# Altium project 23005.PrjPCB
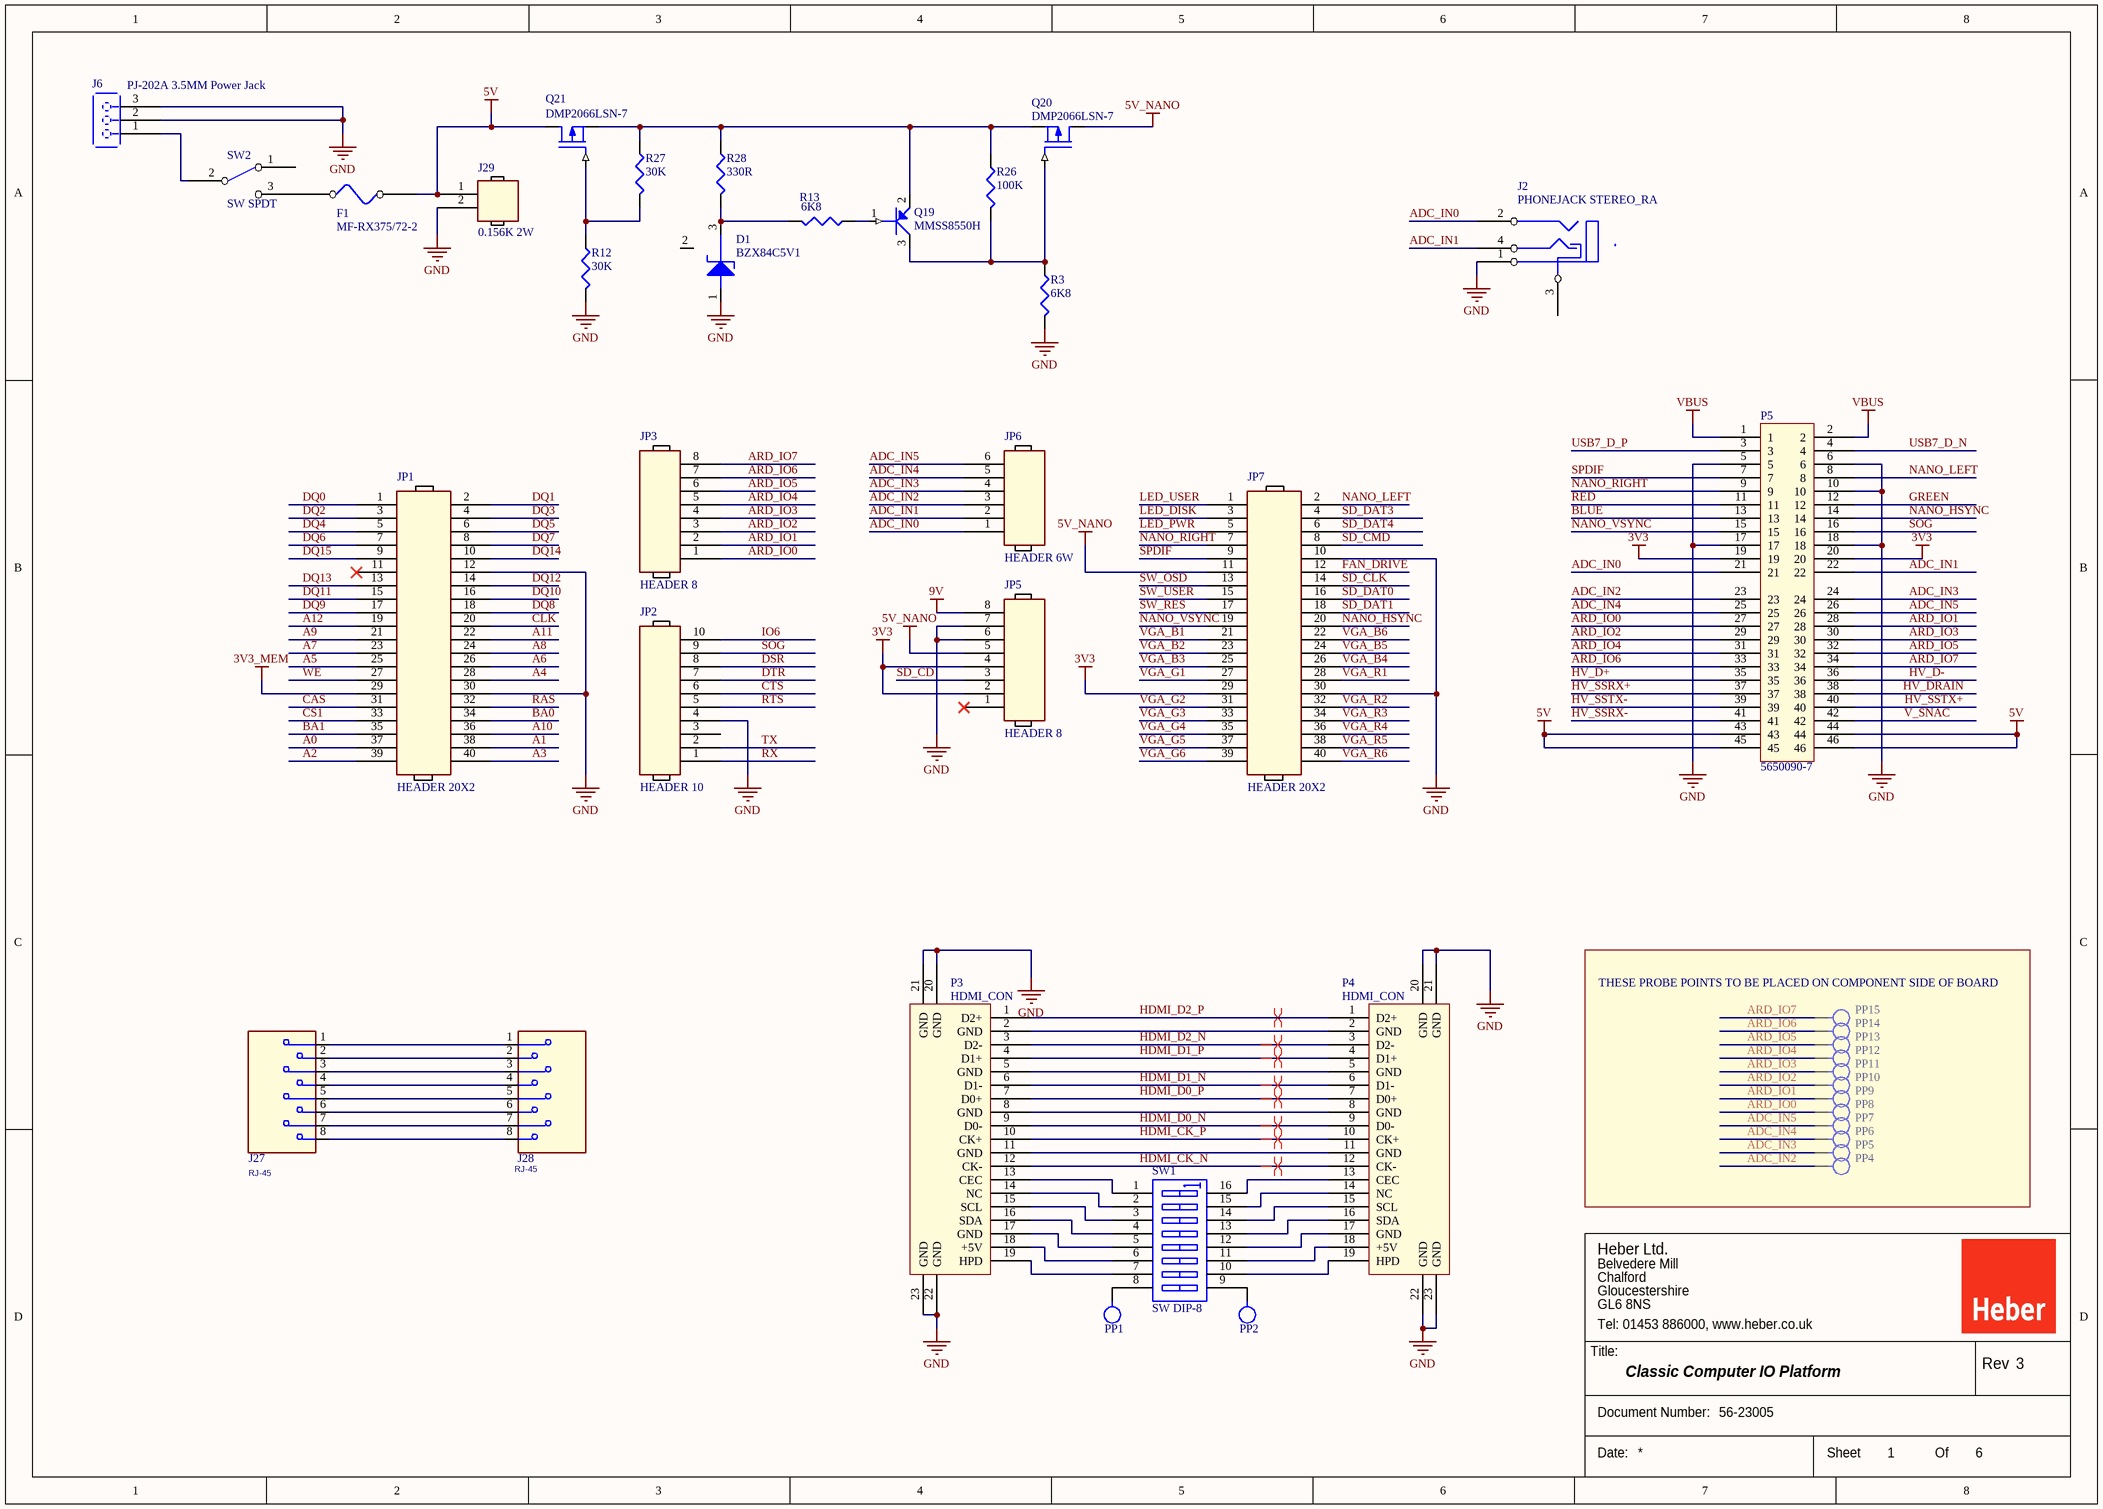
[diagram p0: 23005_1.SchDoc]
6 sheets, 179 parts. Net scope: global (net labels, ports and power ports of the same name join across sheets).
Board file: 23005.PcbDoc
Sheets:
  23005_1.SchDoc
  23005_2.SchDoc
  23005_3.SchDoc
  23005_4.SchDoc
  23005_5.SchDoc
  23005_6.SchDoc

## Sheet 23005_1.SchDoc: Classic Computer IO Platform
size A3; Date: 06/11/2018; CompanyName: Heber Ltd; Organization: Heber Limited; DocumentNumber: 56-23005; 1: 1; SheetNumber: 1; SheetTotal: 6; Revision: 2

### Parts
D1  BZX84C5V1  [SOT23]
F1  MF-RX375/72-2  [FUSE-MF-RX375/72-2]
J2  PHONEJACK STEREO_RA  [JACKSOCKET-STEREO]
J6  PJ-202A 3.5MM Power Jack  [CUI_PJ-202A]
J27  RJ-45  [P-RJHSE-XE80]
J28  RJ-45  [P-RJHSE-XE80]
J29  0.156K 2W  [2W156KK]
JP1  HEADER 20X2  [40WHDR_20X2 - DE10-NANO]
JP2  HEADER 10  [10WSIL]
JP3  HEADER 8  [8WSIL]
JP5  HEADER 8  [8WSIL]
JP6  HEADER 6W  [6WSIL]
JP7  HEADER 20X2  [40WHDR_20X2 - DE10-NANO]
P3  HDMI_CON  [AMPFCI_1029449]
P4  HDMI_CON  [AMPFCI_1029449]
P5  5650090-7  [AMC_RISER2]
PP1  PROBEPOINT_SHORT  [1MM_WIRING]  (value not drawn)
PP2  PROBEPOINT_SHORT  [1MM_WIRING]  (value not drawn)
PP4  PROBEPOINT_SHORT  [PROBEPOINT]  (value not drawn)
PP5  PROBEPOINT_SHORT  [PROBEPOINT]  (value not drawn)
PP6  PROBEPOINT_SHORT  [PROBEPOINT]  (value not drawn)
PP7  PROBEPOINT_SHORT  [PROBEPOINT]  (value not drawn)
PP8  PROBEPOINT_SHORT  [PROBEPOINT]  (value not drawn)
PP9  PROBEPOINT_SHORT  [PROBEPOINT]  (value not drawn)
PP10  PROBEPOINT_SHORT  [PROBEPOINT]  (value not drawn)
PP11  PROBEPOINT_SHORT  [PROBEPOINT]  (value not drawn)
PP12  PROBEPOINT_SHORT  [PROBEPOINT]  (value not drawn)
PP13  PROBEPOINT_SHORT  [PROBEPOINT]  (value not drawn)
PP14  PROBEPOINT_SHORT  [PROBEPOINT]  (value not drawn)
PP15  PROBEPOINT_SHORT  [PROBEPOINT]  (value not drawn)
Q19  MMSS8550H  [SOT23]
Q20  DMP2066LSN-7  [SOT23]
Q21  DMP2066LSN-7  [SOT23]
R3  6K8  [SM0603]
R12  30K  [SM0603]
R13  6K8  [SM0603]
R26  100K  [SM0603]
R27  30K  [SM0603]
R28  330R  [SM0603]
SW1  SW DIP-8  [8WSWITCH]
SW2  SW SPDT  [SW_CK_L102011ml04Q]

### Blocks framed on the sheet
THESE PROBE POINTS TO BE PLACED ON COMPONENT SIDE OF BOARD: PP4-PP15

### Nets
3V3: JP5.2 JP5.4 JP7.29 P5.19 P5.20
3V3_MEM: JP1.29
5V: F1.2 J29.1 P5.43 P5.44 P5.45 P5.46 Q21.3(DRAIN)
5V_NANO: JP5.5 JP7.11 Q20.3(DRAIN)
9V: JP5.8
GND: D1.1(ANODE) J2.1 J6.2 J6.3 J29.2 JP1.12 JP1.30 JP2.4 JP5.6 JP5.7 JP7.10 JP7.30 P3.20(GND) P3.21(GND) P3.22(GND) P3.23(GND) P4.20(GND) P4.21(GND) P4.22(GND) P4.23(GND) P5.5 P5.6 P5.10 P5.17 P5.18 R3.2 R12.2
V_SNAC: P5.42
VBUS: P5.1 P5.2
A0: JP1.37
A1: JP1.38
A2: JP1.39
A3: JP1.40
A4: JP1.28
A5: JP1.25
A6: JP1.26
A7: JP1.23
A8: JP1.24
A9: JP1.21
A10: JP1.36
A11: JP1.22
A12: JP1.19
ADC_IN0: J2.2 JP6.1 P5.21
ADC_IN1: J2.4 JP6.2 P5.22
ADC_IN2: JP6.3 P5.23 PP4.1
ADC_IN3: JP6.4 P5.24 PP5.1
ADC_IN4: JP6.5 P5.25 PP6.1
ADC_IN5: JP6.6 P5.26 PP7.1
ARD_IO0: JP3.1 P5.27 PP8.1
ARD_IO1: JP3.2 P5.28 PP9.1
ARD_IO2: JP3.3 P5.29 PP10.1
ARD_IO3: JP3.4 P5.30 PP11.1
ARD_IO4: JP3.5 P5.31 PP12.1
ARD_IO5: JP3.6 P5.32 PP13.1
ARD_IO6: JP3.7 P5.33 PP14.1
ARD_IO7: JP3.8 P5.34 PP15.1
BA0: JP1.34
BA1: JP1.35
BLUE: P5.13
CAS: JP1.31
CLK: JP1.20
CS1: JP1.33
CTS: JP2.6
DQ0: JP1.1
DQ1: JP1.2
DQ2: JP1.3
DQ3: JP1.4
DQ4: JP1.5
DQ5: JP1.6
DQ6: JP1.7
DQ7: JP1.8
DQ8: JP1.18
DQ9: JP1.17
DQ10: JP1.16
DQ11: JP1.15
DQ12: JP1.14
DQ13: JP1.13
DQ14: JP1.10
DQ15: JP1.9
DSR: JP2.8
DTR: JP2.7
FAN_DRIVE: JP7.12
GREEN: P5.12
HDMI_CK_N: P3.12(CK-) P4.12(CK-)
HDMI_CK_P: P3.10(CK+) P4.10(CK+)
HDMI_D0_N: P3.9(D0-) P4.9(D0-)
HDMI_D0_P: P3.7(D0+) P4.7(D0+)
HDMI_D1_N: P3.6(D1-) P4.6(D1-)
HDMI_D1_P: P3.4(D1+) P4.4(D1+)
HDMI_D2_N: P3.3(D2-) P4.3(D2-)
HDMI_D2_P: P3.1(D2+) P4.1(D2+)
HV_D+: P5.35
HV_D-: P5.36
HV_DRAIN: P5.38
HV_SSRX+: P5.37
HV_SSRX-: P5.41
HV_SSTX+: P5.40
HV_SSTX-: P5.39
IO6: JP2.10
LED_DISK: JP7.3
LED_PWR: JP7.5
LED_USER: JP7.1
NANO_HSYNC: JP7.20 P5.14
NANO_LEFT: JP7.2 P5.8
NANO_RIGHT: JP7.7 P5.9
NANO_VSYNC: JP7.19 P5.15
RAS: JP1.32
RED: P5.11
RTS: JP2.5
RX: JP2.1
SD_CD: JP5.3
SD_CLK: JP7.14
SD_CMD: JP7.8
SD_DAT0: JP7.16
SD_DAT1: JP7.18
SD_DAT3: JP7.4
SD_DAT4: JP7.6
SOG: JP2.9 P5.16
SPDIF: JP7.9 P5.7
SW_OSD: JP7.13
SW_RES: JP7.17
SW_USER: JP7.15
TX: JP2.2
USB7_D_N: P5.4
USB7_D_P: P5.3
VGA_B1: JP7.21
VGA_B2: JP7.23
VGA_B3: JP7.25
VGA_B4: JP7.26
VGA_B5: JP7.24
VGA_B6: JP7.22
VGA_G1: JP7.27
VGA_G2: JP7.31
VGA_G3: JP7.33
VGA_G4: JP7.35
VGA_G5: JP7.37
VGA_G6: JP7.39
VGA_R1: JP7.28
VGA_R2: JP7.32
VGA_R3: JP7.34
VGA_R4: JP7.36
VGA_R5: JP7.38
VGA_R6: JP7.40
WE: JP1.27
NetD1_3: D1.3(CATHODE) R13.2 R28.2
NetF1_1: F1.1 SW2.3(NO)
NetJ6_1: J6.1 SW2.2(COMMON)
NetJ27_1: J27.1 J28.1
NetJ27_2: J27.2 J28.2
NetJ27_3: J27.3 J28.3
NetJ27_4: J27.4 J28.4
NetJ27_5: J27.5 J28.5
NetJ27_6: J27.6 J28.6
NetJ27_7: J27.7 J28.7
NetJ27_8: J27.8 J28.8
NetP3_2: P3.2(GND) P4.2(GND)
NetP3_5: P3.5(GND) P4.5(GND)
NetP3_8: P3.8(GND) P4.8(GND)
NetP3_11: P3.11(GND) P4.11(GND)
NetP3_13: P3.13(CEC) SW1.1(A1)
NetP3_14: P3.14(NC) SW1.2(A2)
NetP3_15: P3.15(SCL) SW1.3(A3)
NetP3_16: P3.16(SDA) SW1.4(A4)
NetP3_17: P3.17(GND) SW1.5(A5)
NetP3_18: P3.18(+5V) SW1.6(A6)
NetP3_19: P3.19(HPD) SW1.7(A7)
NetP4_13: P4.13(CEC) SW1.16(B1)
NetP4_14: P4.14(NC) SW1.15(B2)
NetP4_15: P4.15(SCL) SW1.14(B3)
NetP4_16: P4.16(SDA) SW1.13(B4)
NetP4_17: P4.17(GND) SW1.12(B5)
NetP4_18: P4.18(+5V) SW1.11(B6)
NetP4_19: P4.19(HPD) SW1.10(B7)
NetPP1_1: PP1.1 SW1.8(A8)
NetPP2_1: PP2.1 SW1.9(B8)
NetQ19_1: Q19.1(BASE) R13.1
NetQ19_2: Q19.2(EMITTER) Q20.2(SOURCE) Q21.2(SOURCE) R26.1 R27.1 R28.1
NetQ19_3: Q19.3(COLLECTOR) Q20.1(GATE) R3.1 R26.2
NetQ21_1: Q21.1(GATE) R12.1 R27.2

Not connected (* = marked no-connect by the designer): D1 2(NC); J2 3; JP1 11*; JP2 3; JP5 1*; SW2 1(NC)

### Layout directives
differential pair; differential pair class HDMI: HDMI_CK_N, HDMI_CK_P, HDMI_D0_N, HDMI_D0_P, HDMI_D1_N, HDMI_D1_P, HDMI_D2_N, HDMI_D2_P

### Notes on the sheet
- Heber Ltd.
- Belvedere Mill
- Chalford
- GL6 8NS
- Gloucestershire
- Tel: 01453 886000, www.heber.co.uk
- Title:
- Rev
- 3
- Document Number:
- Date:
- Sheet
- Of

### Library data of the parts
D1 = ZENNER_SOT23
F1 = FUSE
J6 = PLUG 3W SIL
J27 J28 = RJ45
J29 = HEADER 2
Q19 = BC856AL
Q20 Q21 = MOSFET P
R3 R12 R13 R26-R28 = RES

## Sheet 23005_2.SchDoc: Classic Computer IO Platform
size A3; Date: 06/11/2018; CompanyName: Heber Ltd; Organization: Heber Limited; DocumentNumber: 56-23005; Revision: 3; SheetNumber: 2; SheetTotal: 6
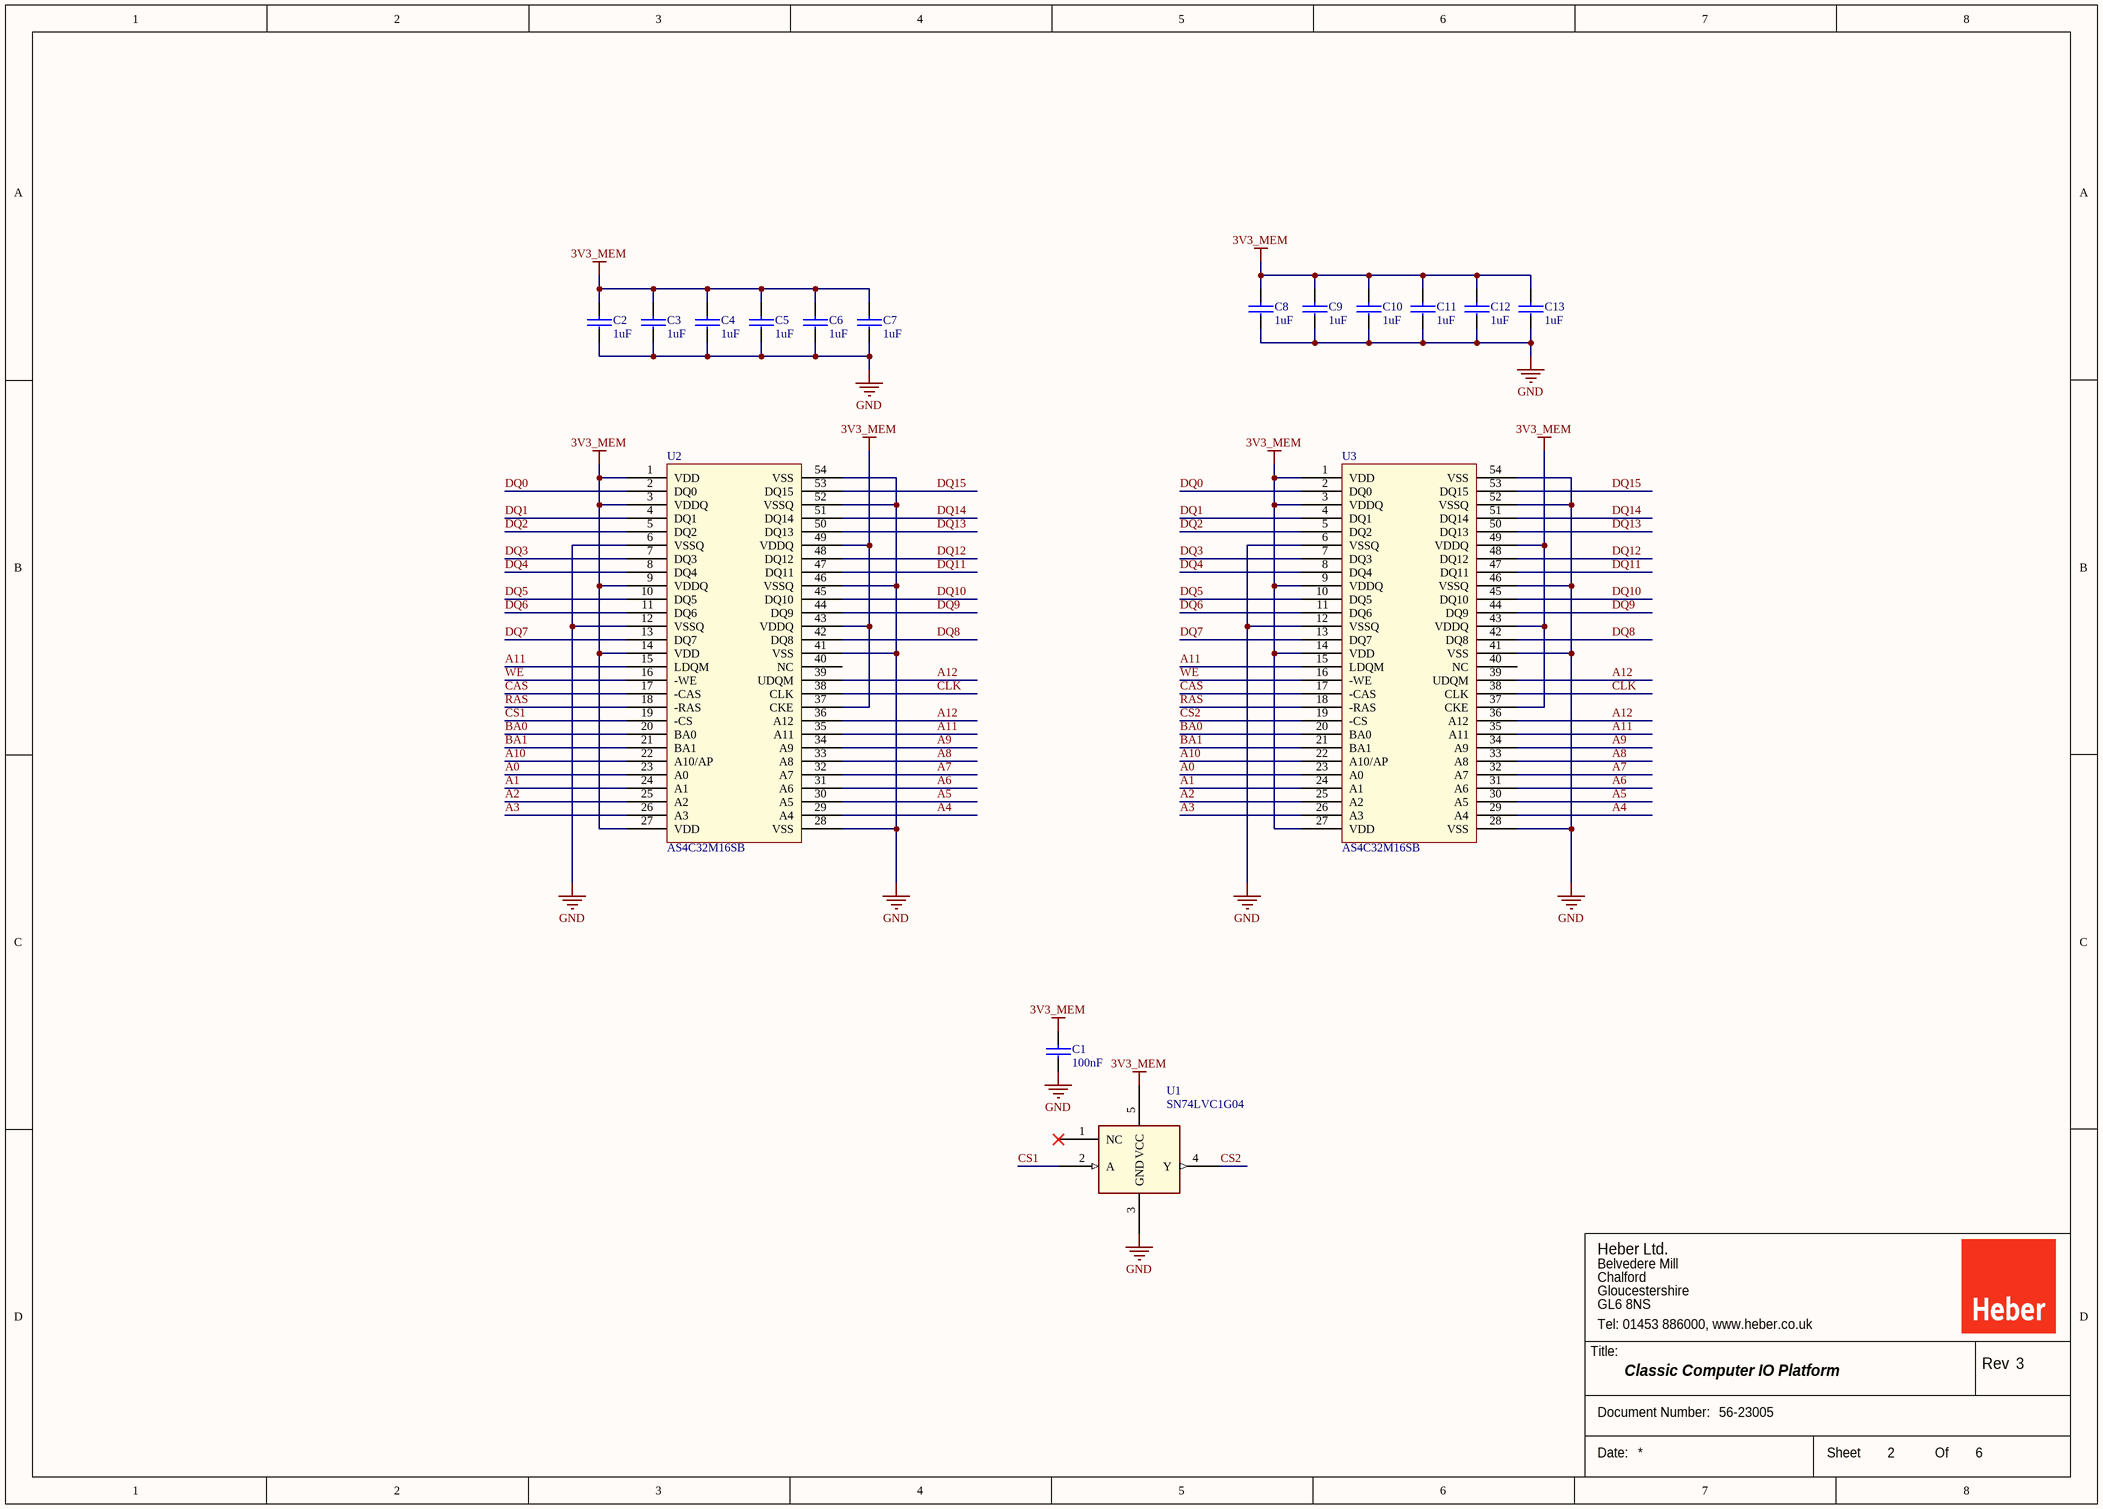
[diagram p1: 23005_2.SchDoc]

### Parts
C1  100nF  [SM0603]
C2  1uF  [SM0603]
C3  1uF  [SM0603]
C4  1uF  [SM0603]
C5  1uF  [SM0603]
C6  1uF  [SM0603]
C7  1uF  [SM0603]
C8  1uF  [SM0603]
C9  1uF  [SM0603]
C10  1uF  [SM0603]
C11  1uF  [SM0603]
C12  1uF  [SM0603]
C13  1uF  [SM0603]
U1  SN74LVC1G04  [SOT23-5]
U2  AS4C32M16SB  [TSOP54/080]
U3  AS4C32M16SB  [TSOP54/080]

### Nets
3V3_MEM: C1.1 C2.1 C3.1 C4.1 C5.1 C6.1 C7.1 C8.1 C9.1 C10.1 C11.1 C12.1 C13.1 U1.5(VCC) U2.1(VDD) U2.3(VDDQ) U2.9(VDDQ) U2.14(VDD) U2.27(VDD) U2.37(CKE) U2.43(VDDQ) U2.49(VDDQ) U3.1(VDD) U3.3(VDDQ) U3.9(VDDQ) U3.14(VDD) U3.27(VDD) U3.37(CKE) U3.43(VDDQ) U3.49(VDDQ)
GND: C1.2 C2.2 C3.2 C4.2 C5.2 C6.2 C7.2 C8.2 C9.2 C10.2 C11.2 C12.2 C13.2 U1.3(GND) U2.6(VSSQ) U2.12(VSSQ) U2.28(VSS) U2.41(VSS) U2.46(VSSQ) U2.52(VSSQ) U2.54(VSS) U3.6(VSSQ) U3.12(VSSQ) U3.28(VSS) U3.41(VSS) U3.46(VSSQ) U3.52(VSSQ) U3.54(VSS)
A0: U2.23(A0) U3.23(A0)
A1: U2.24(A1) U3.24(A1)
A2: U2.25(A2) U3.25(A2)
A3: U2.26(A3) U3.26(A3)
A4: U2.29(A4) U3.29(A4)
A5: U2.30(A5) U3.30(A5)
A6: U2.31(A6) U3.31(A6)
A7: U2.32(A7) U3.32(A7)
A8: U2.33(A8) U3.33(A8)
A9: U2.34(A9) U3.34(A9)
A10: U2.22(A10/AP) U3.22(A10/AP)
A11: U2.15(LDQM) U2.35(A11) U3.15(LDQM) U3.35(A11)
A12: U2.36(A12) U2.39(UDQM) U3.36(A12) U3.39(UDQM)
BA0: U2.20(BA0) U3.20(BA0)
BA1: U2.21(BA1) U3.21(BA1)
CAS: U2.17(-CAS) U3.17(-CAS)
CLK: U2.38(CLK) U3.38(CLK)
CS1: U1.2(A) U2.19(-CS)
CS2: U1.4(Y) U3.19(-CS)
DQ0: U2.2(DQ0) U3.2(DQ0)
DQ1: U2.4(DQ1) U3.4(DQ1)
DQ2: U2.5(DQ2) U3.5(DQ2)
DQ3: U2.7(DQ3) U3.7(DQ3)
DQ4: U2.8(DQ4) U3.8(DQ4)
DQ5: U2.10(DQ5) U3.10(DQ5)
DQ6: U2.11(DQ6) U3.11(DQ6)
DQ7: U2.13(DQ7) U3.13(DQ7)
DQ8: U2.42(DQ8) U3.42(DQ8)
DQ9: U2.44(DQ9) U3.44(DQ9)
DQ10: U2.45(DQ10) U3.45(DQ10)
DQ11: U2.47(DQ11) U3.47(DQ11)
DQ12: U2.48(DQ12) U3.48(DQ12)
DQ13: U2.50(DQ13) U3.50(DQ13)
DQ14: U2.51(DQ14) U3.51(DQ14)
DQ15: U2.53(DQ15) U3.53(DQ15)
RAS: U2.18(-RAS) U3.18(-RAS)
WE: U2.16(-WE) U3.16(-WE)

Not connected (* = marked no-connect by the designer): U1 1(NC)*; U2 40(NC); U3 40(NC)

### Notes on the sheet
- Heber Ltd.
- Belvedere Mill
- Chalford
- GL6 8NS
- Gloucestershire
- Tel: 01453 886000, www.heber.co.uk
- Title:
- Rev
- Document Number:
- Date:
- Sheet
- Of

### Library data of the parts
C1-C13 = C
U1 = SN74LVC1G07

## Sheet 23005_3.SchDoc: Classic Computer IO Platform
size A3; Date: 06/11/2018; CompanyName: Heber Ltd; Organization: Heber Limited; DocumentNumber: 56-23005; Revision: 3; SheetNumber: 3; SheetTotal: 6
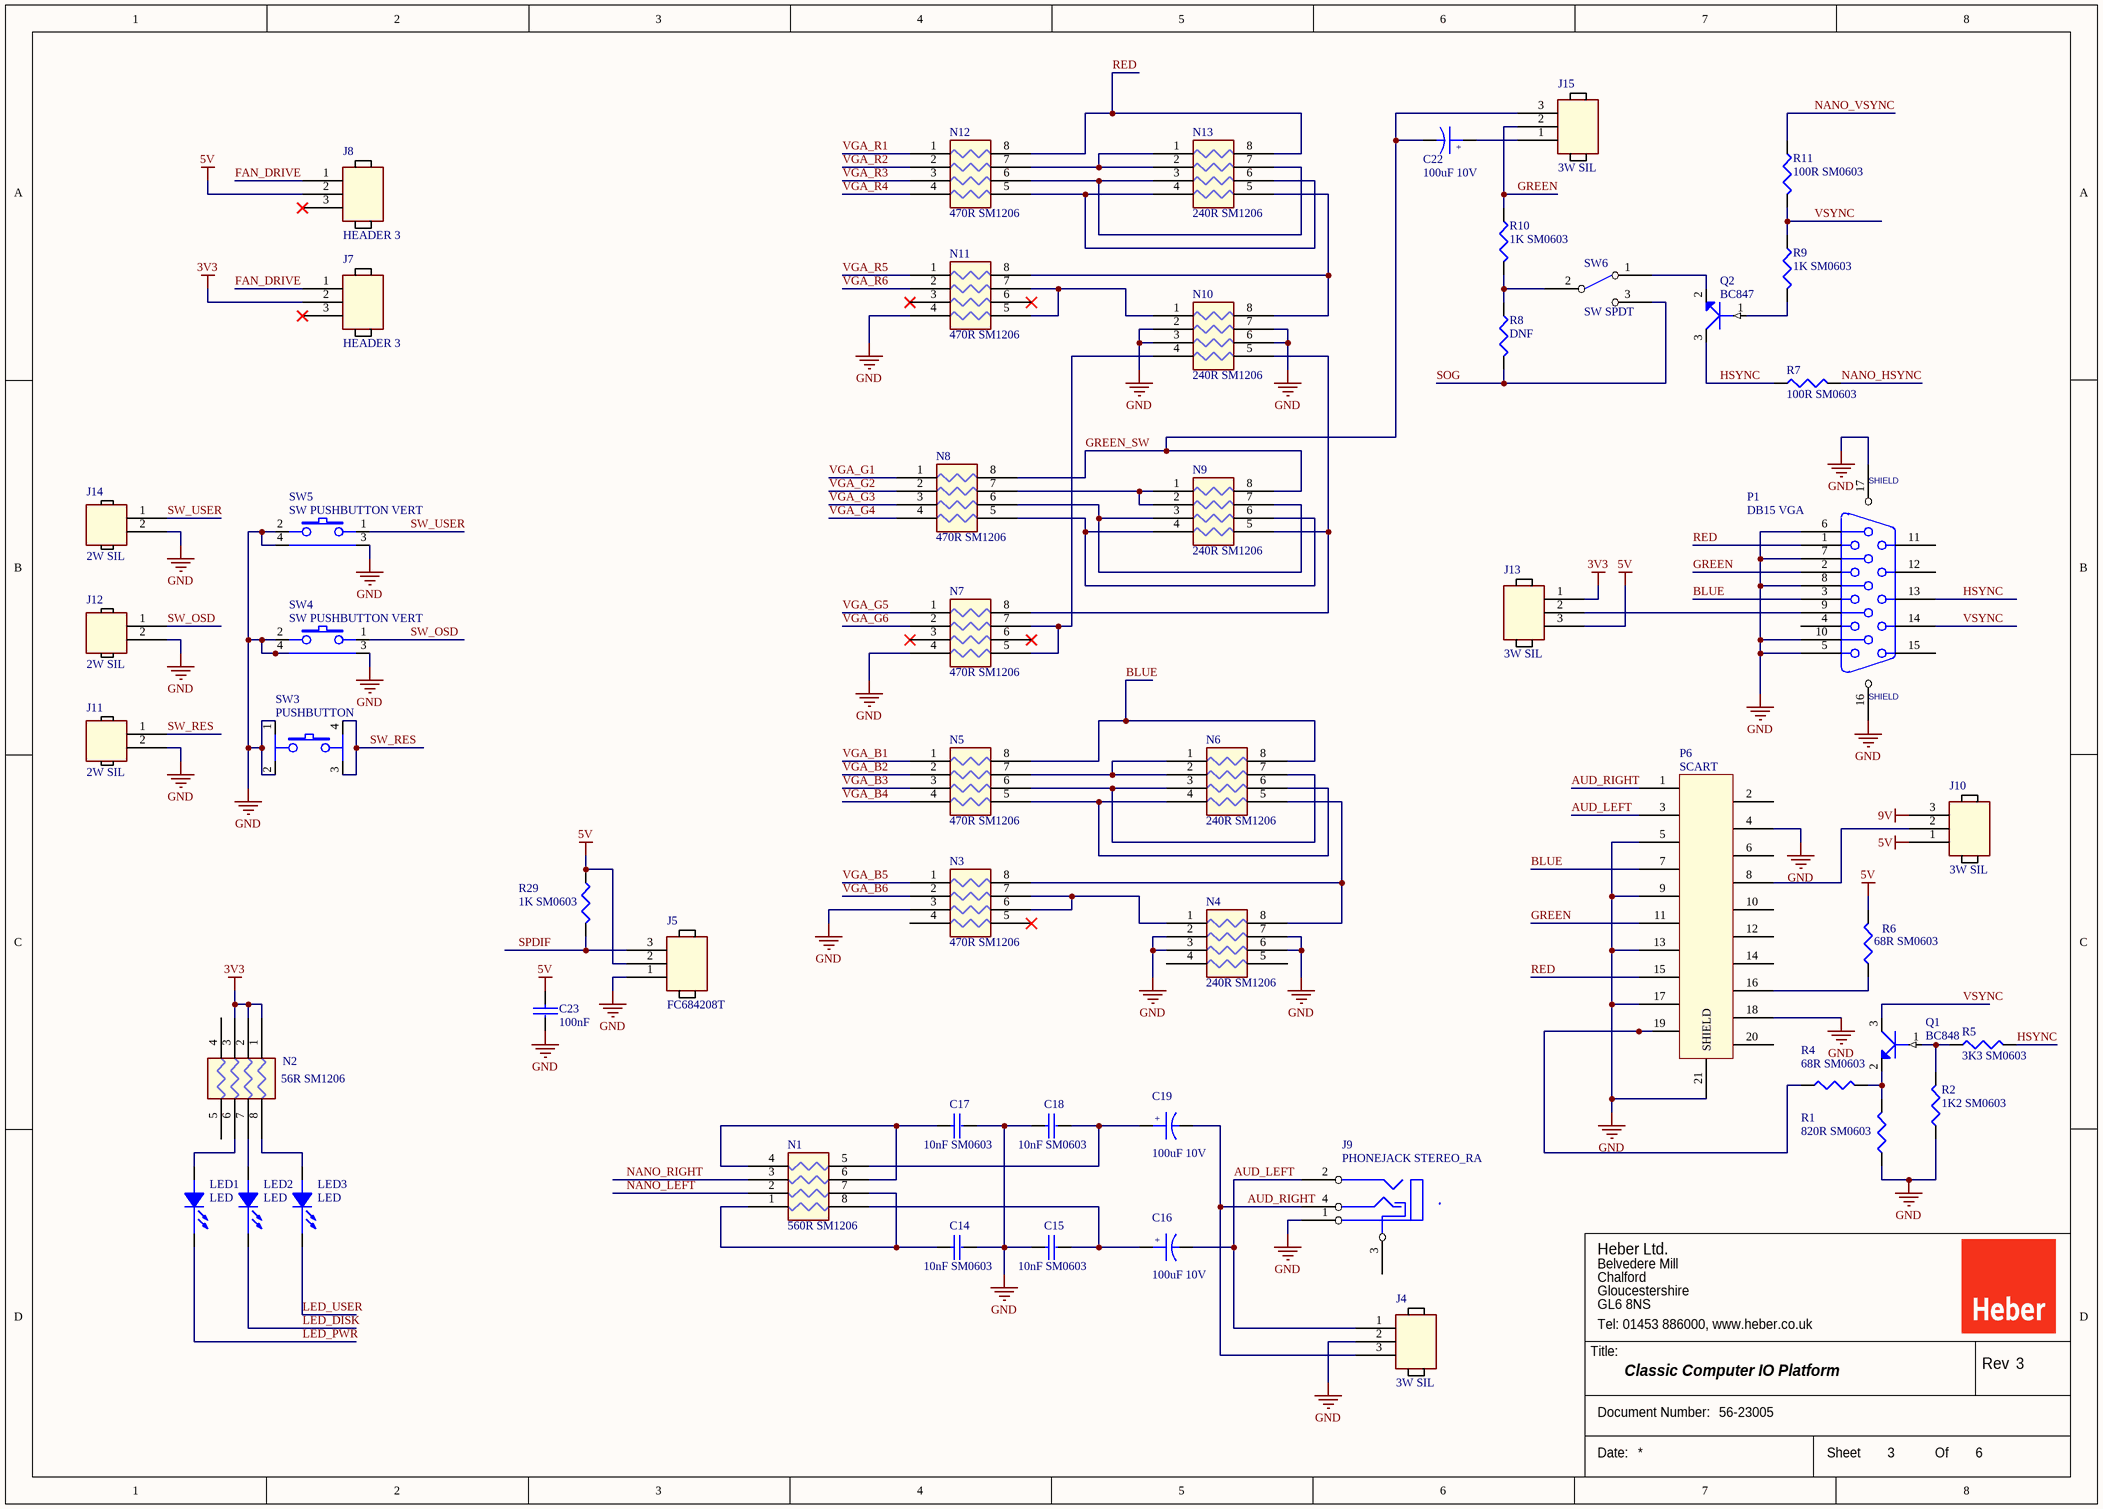
[diagram p2: 23005_3.SchDoc]

### Parts
C14  10nF SM0603  [SM0603]
C15  10nF SM0603  [SM0603]
C16  100uF 10V  [SM1206]
C17  10nF SM0603  [SM0603]
C18  10nF SM0603  [SM0603]
C19  100uF 10V  [SM1206]
C22  100uF 10V  [SM1206]
C23  100nF  [SM0603]
J4  3W SIL  [3WSIL]
J5  FC684208T  [FCR684208T]
J7  HEADER 3  [3W0.1KK]
J8  HEADER 3  [3W0.1KK]
J9  PHONEJACK STEREO_RA  [JACKSOCKET-STEREO]
J10  3W SIL  [3WSIL]
J11  2W SIL  [2WSIL]
J12  2W SIL  [2WSIL]
J13  3W SIL  [3WSIL]
J14  2W SIL  [2WSIL]
J15  3W SIL  [3WSIL]
LED1  LED  [SM0603LED_1]
LED2  LED  [SM0603LED_1]
LED3  LED  [SM0603LED_1]
N1  560R SM1206  [1206RES4_I2]
N2  56R SM1206  [1206RES4_I2]
N3  470R SM1206  [1206RES4_I2]
N4  240R SM1206  [1206RES4_I2]
N5  470R SM1206  [1206RES4_I2]
N6  240R SM1206  [1206RES4_I2]
N7  470R SM1206  [1206RES4_I2]
N8  470R SM1206  [1206RES4_I2]
N9  240R SM1206  [1206RES4_I2]
N10  240R SM1206  [1206RES4_I2]
N11  470R SM1206  [1206RES4_I2]
N12  470R SM1206  [1206RES4_I2]
N13  240R SM1206  [1206RES4_I2]
P1  DB15 VGA  [15WVGASKTRA]
P6  SCART  [K-SCART-024]
Q1  BC848  [SOT23]
Q2  BC847  [SOT23]
R1  820R SM0603  [SM0603]
R2  1K2 SM0603  [SM0603]
R4  68R SM0603  [SM0603]
R5  3K3 SM0603  [SM0603]
R6  68R SM0603  [SM0603]
R7  100R SM0603  [SM0603]
R8  DNF  [SM0603]
R9  1K SM0603  [SM0603]
R10  1K SM0603  [SM0603]
R11  100R SM0603  [SM0603]
R29  1K SM0603  [SM0603]
SW3  PUSHBUTTON  [SW_SM_6MM]
SW4  SW PUSHBUTTON VERT  [SW_TS6H2A]
SW5  SW PUSHBUTTON VERT  [SW_TS6H2A]
SW6  SW SPDT  [SW_ITT_OS102011MS2QN1]

### Nets
3V3: J7.2 J13.1 N2.1 N2.2 N2.3
5V: C23.1 J5.2 J8.2 J10.1 J13.3 R6.2 R29.1
9V: J10.3
GND: C14.2 C15.1 C17.2 C18.1 C23.2 J4.2 J5.1 J9.1 J11.2 J12.2 J14.2 N3.3 N4.2 N4.3 N4.6 N4.7 N7.4 N10.2 N10.3 N10.6 N10.7 N11.4 P1.5 P1.6 P1.7 P1.8 P1.10 P1.16 P1.17 P6.4 P6.5 P6.9 P6.13 P6.17 P6.18 P6.21(SHIELD) R1.2 R2.2 SW3.1 SW3.2 SW4.2 SW4.3 SW4.4 SW5.2 SW5.3 SW5.4
AUD_LEFT: C16.2 J4.1 J9.2 P6.3
AUD_RIGHT: C19.2 J4.3 J9.4 P6.1
BLUE: N5.8 N6.8 P1.3 P6.7
FAN_DRIVE: J7.1 J8.1
GREEN: J15.2 P1.2 P6.11 R10.1
GREEN_SW: C22.2 J15.3 N8.8 N9.8
HSYNC: P1.13 Q2.3(C) R5.1 R7.1
LED_DISK: LED2.2(CATHODE)
LED_PWR: LED1.2(CATHODE)
LED_USER: LED3.2(CATHODE)
NANO_HSYNC: R7.2
NANO_LEFT: N1.2
NANO_RIGHT: N1.3
NANO_VSYNC: R11.1
RED: N12.8 N13.8 P1.1 P6.15
SOG: R8.2 SW6.3(NO)
SPDIF: J5.3 R29.2
SW_OSD: J12.1 SW4.1
SW_RES: J11.1 SW3.3 SW3.4
SW_USER: J14.1 SW5.1
VGA_B1: N5.1
VGA_B2: N5.2
VGA_B3: N5.3
VGA_B4: N5.4
VGA_B5: N3.1
VGA_B6: N3.2
VGA_G1: N8.1
VGA_G2: N8.2
VGA_G3: N8.3
VGA_G4: N8.4
VGA_G5: N7.1
VGA_G6: N7.2
VGA_R1: N12.1
VGA_R2: N12.2
VGA_R3: N12.3
VGA_R4: N12.4
VGA_R5: N11.1
VGA_R6: N11.2
VSYNC: P1.14 Q1.3(C) R9.1 R11.2
NetC14_1: C14.1 N1.1 N1.7
NetC15_2: C15.2 C16.1 N1.8
NetC17_1: C17.1 N1.4 N1.6
NetC18_2: C18.2 C19.1 N1.5
NetC22_1: C22.1 J15.1
NetJ10_2: J10.2 P6.8
NetJ13_2: J13.2 P1.9
NetLED1_1: LED1.1(ANODE) N2.6
NetLED2_1: LED2.1(ANODE) N2.7
NetLED3_1: LED3.1(ANODE) N2.8
NetN3_6: N3.6 N3.7 N4.1
NetN3_8: N3.8 N4.8 N6.5
NetN5_5: N5.5 N6.4 N6.6
NetN5_6: N5.6 N6.3 N6.7
NetN5_7: N5.7 N6.1 N6.2
NetN7_5: N7.5 N7.7 N10.4
NetN7_8: N7.8 N9.5 N10.5
NetN8_5: N8.5 N9.4 N9.6
NetN8_6: N8.6 N9.3 N9.7
NetN8_7: N8.7 N9.1 N9.2
NetN10_1: N10.1 N11.5 N11.7
NetN10_8: N10.8 N11.8 N13.5
NetN12_5: N12.5 N13.4 N13.6
NetN12_6: N12.6 N13.3 N13.7
NetN12_7: N12.7 N13.1 N13.2
NetP6_16: P6.16 R6.1
NetP6_19: P6.19 R4.2
NetQ1_1: Q1.1(B) R2.1 R5.2
NetQ1_2: Q1.2(E) R1.1 R4.1
NetQ2_1: Q2.1(B) R9.2
NetQ2_2: Q2.2(E) SW6.1(NC)
NetR8_1: R8.1 R10.2 SW6.2(COMMON)

Not connected (* = marked no-connect by the designer): J7 3*; J8 3*; J9 3; N2 4 5; N3 4 5*; N4 4 5; N7 3* 6*; N11 3* 6*; P1 4 11 12 15; P6 2(107) 6(111) 10(112) 12(112) 14(112) 20(112)

### Notes on the sheet
- Heber Ltd.
- Belvedere Mill
- Chalford
- GL6 8NS
- Gloucestershire
- Tel: 01453 886000, www.heber.co.uk
- Title:
- Rev
- Document Number:
- Date:
- Sheet
- Of
- (in symbol CAP_POL) +
- (in symbol CONNECTOR DB15 VGA SHIELDED) SHIELD

### Library data of the parts
C14 C15 C17 C18 C23 = C
C16 C19 C22 = CAP_POL
J4 J5 J10 J13 J15 = HEADER 3
J11 J12 J14 = HEADER 2
N1-N13 = RESISTOR DIP 4
P1 = CONNECTOR DB15 VGA SHIELDED
Q1 Q2 = BC846AL_1
R1 R2 R4-R11 R29 = RES
SW3 = SW PUSHBUTTON

## Sheet 23005_4.SchDoc: Classic Computer IO Platform
size A3; Date: 06/11/2018; CompanyName: Heber Ltd; Organization: Heber Limited; DocumentNumber: 56-23005; Revision: 3; SheetNumber: 4; SheetTotal: 6
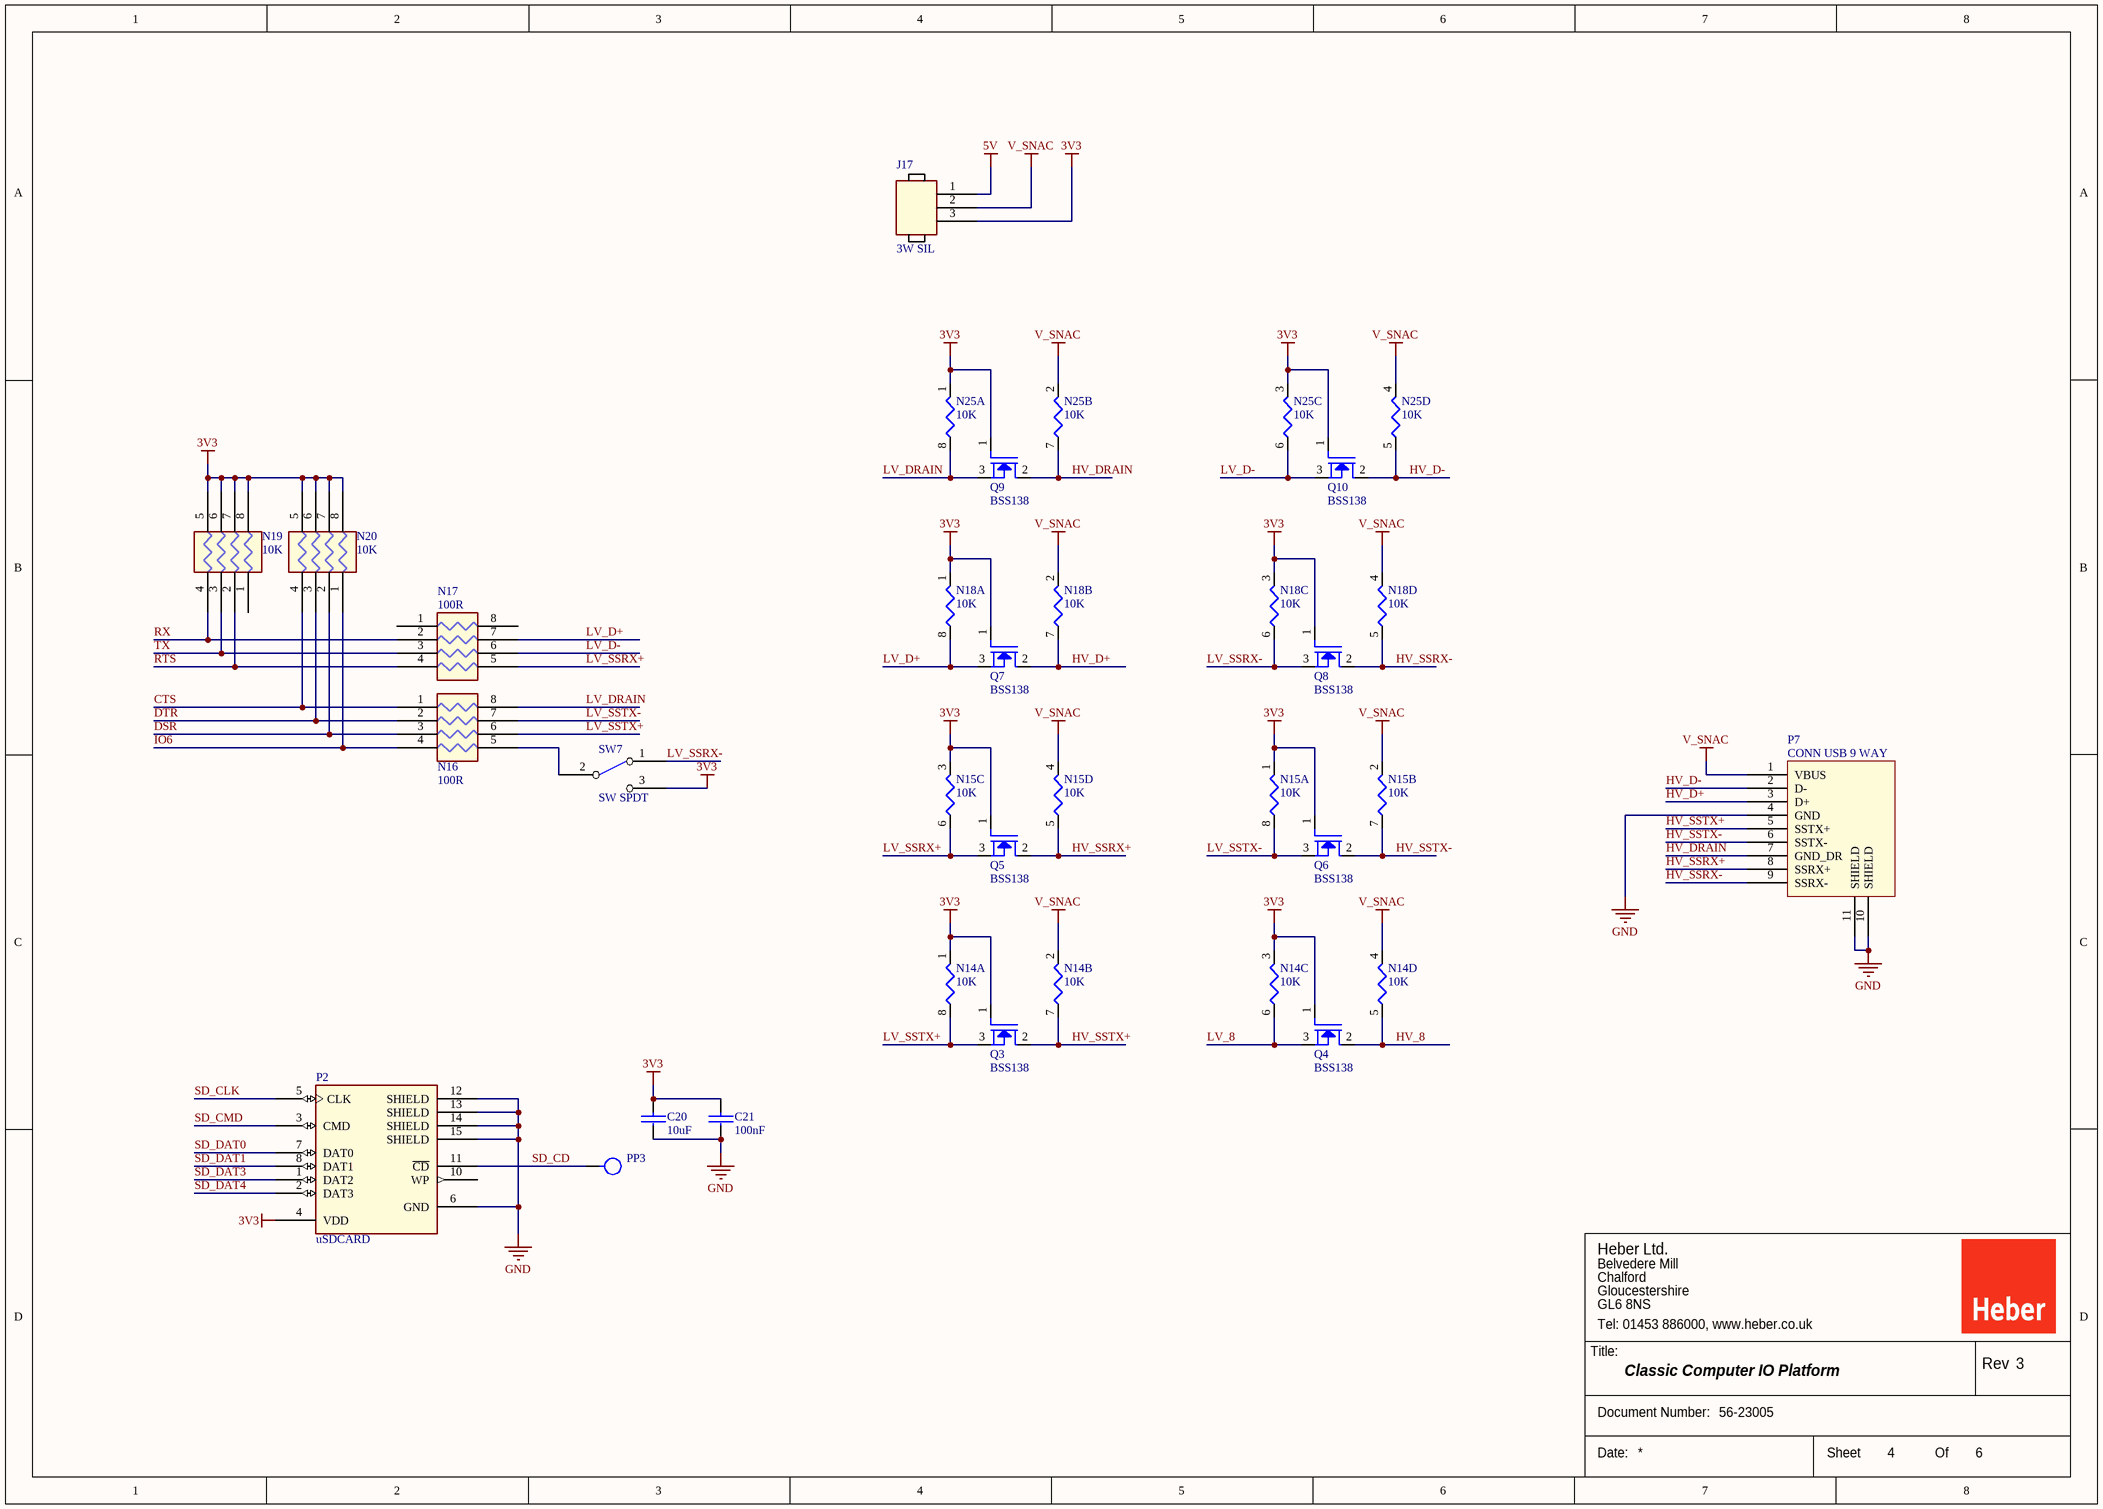
[diagram p3: 23005_4.SchDoc]

### Parts
C20  10uF  [SM0805]
C21  100nF  [SM0603]
J17  3W SIL  [3WSIL]
N14  10K  [1206RES4_I2]  (parts A,B,C,D of 4)
N15  10K  [1206RES4_I2]  (parts A,B,C,D of 4)
N16  100R  [1206RES4_I2]
N17  100R  [1206RES4_I2]
N18  10K  [1206RES4_I2]  (parts A,B,C,D of 4)
N19  10K  [1206RES4_I2]
N20  10K  [1206RES4_I2]
N25  10K  [1206RES4_I2]  (parts A,B,C,D of 4)
P2  uSDCARD  [AMP_114-00841-68]
P7  CONN USB 9 WAY  [WURTH_692121030100]
PP3  PROBEPOINT_SHORT  [PROBEPOINT]  (value not drawn)
Q3  BSS138  [SOT23]
Q4  BSS138  [SOT23]
Q5  BSS138  [SOT23]
Q6  BSS138  [SOT23]
Q7  BSS138  [SOT23]
Q8  BSS138  [SOT23]
Q9  BSS138  [SOT23]
Q10  BSS138  [SOT23]
SW7  SW SPDT  [SW_ITT_OS102011MS2QN1]

### Nets
3V3: C20.1 C21.1 J17.3 N14.1 N14.3 N15.1 N15.3 N18.1 N18.3 N19.5 N19.6 N19.7 N19.8 N20.5 N20.6 N20.7 N20.8 N25.1 N25.3 P2.4(VDD) Q3.1(GATE) Q4.1(GATE) Q5.1(GATE) Q6.1(GATE) Q7.1(GATE) Q8.1(GATE) Q9.1(GATE) Q10.1(GATE) SW7.3(NO)
5V: J17.1
GND: C20.2 C21.2 P2.6(GND) P2.12(SHIELD) P2.13(SHIELD) P2.14(SHIELD) P2.15(SHIELD) P7.4(GND) P7.10(SHIELD) P7.11(SHIELD)
V_SNAC: J17.2 N14.2 N14.4 N15.2 N15.4 N18.2 N18.4 N25.2 N25.4 P7.1(VBUS)
CTS: N16.1 N20.4
DSR: N16.3 N20.2
DTR: N16.2 N20.3
HV_8: N14.5 Q4.2(DRAIN)
HV_D+: N18.7 P7.3(D+) Q7.2(DRAIN)
HV_D-: N25.5 P7.2(D-) Q10.2(DRAIN)
HV_DRAIN: N25.7 P7.7(GND_DR) Q9.2(DRAIN)
HV_SSRX+: N15.5 P7.8(SSRX+) Q5.2(DRAIN)
HV_SSRX-: N18.5 P7.9(SSRX-) Q8.2(DRAIN)
HV_SSTX+: N14.7 P7.5(SSTX+) Q3.2(DRAIN)
HV_SSTX-: N15.7 P7.6(SSTX-) Q6.2(DRAIN)
IO6: N16.4 N20.1
LV_8: N14.6 Q4.3(SOURCE)
LV_D+: N17.7 N18.8 Q7.3(SOURCE)
LV_D-: N17.6 N25.6 Q10.3(SOURCE)
LV_DRAIN: N16.8 N25.8 Q9.3(SOURCE)
LV_SSRX+: N15.6 N17.5 Q5.3(SOURCE)
LV_SSRX-: N18.6 Q8.3(SOURCE) SW7.1(NC)
LV_SSTX+: N14.8 N16.6 Q3.3(SOURCE)
LV_SSTX-: N15.8 N16.7 Q6.3(SOURCE)
RTS: N17.4 N19.2
RX: N17.2 N19.4
SD_CD: P2.11(~{CD}) PP3.1
SD_CLK: P2.5(CLK)
SD_CMD: P2.3(CMD)
SD_DAT0: P2.7(DAT0)
SD_DAT1: P2.8(DAT1)
SD_DAT3: P2.1(DAT2)
SD_DAT4: P2.2(DAT3)
TX: N17.3 N19.3
NetN16_5: N16.5 SW7.2(COMMON)

Not connected (* = marked no-connect by the designer): N17 1 8; N19 1; P2 10(WP)

### Notes on the sheet
- Heber Ltd.
- Belvedere Mill
- Chalford
- GL6 8NS
- Gloucestershire
- Tel: 01453 886000, www.heber.co.uk
- Title:
- Rev
- Document Number:
- Date:
- Sheet
- Of

### Library data of the parts
C20 C21 = C
J17 = HEADER 3
N14 N15 N18 N25 = RESISTOR DIP 4 A-D
N16 N17 N19 N20 = RESISTOR DIP 4
Q3-Q10 = MOSFET N_0

## Sheet 23005_5.SchDoc: Classic Computer IO Platform
size A3; Date: 06/11/2018; CompanyName: Heber Ltd; Organization: Heber Limited; DocumentNumber: 56-23005; Revision: 3; SheetNumber: 5; SheetTotal: 6
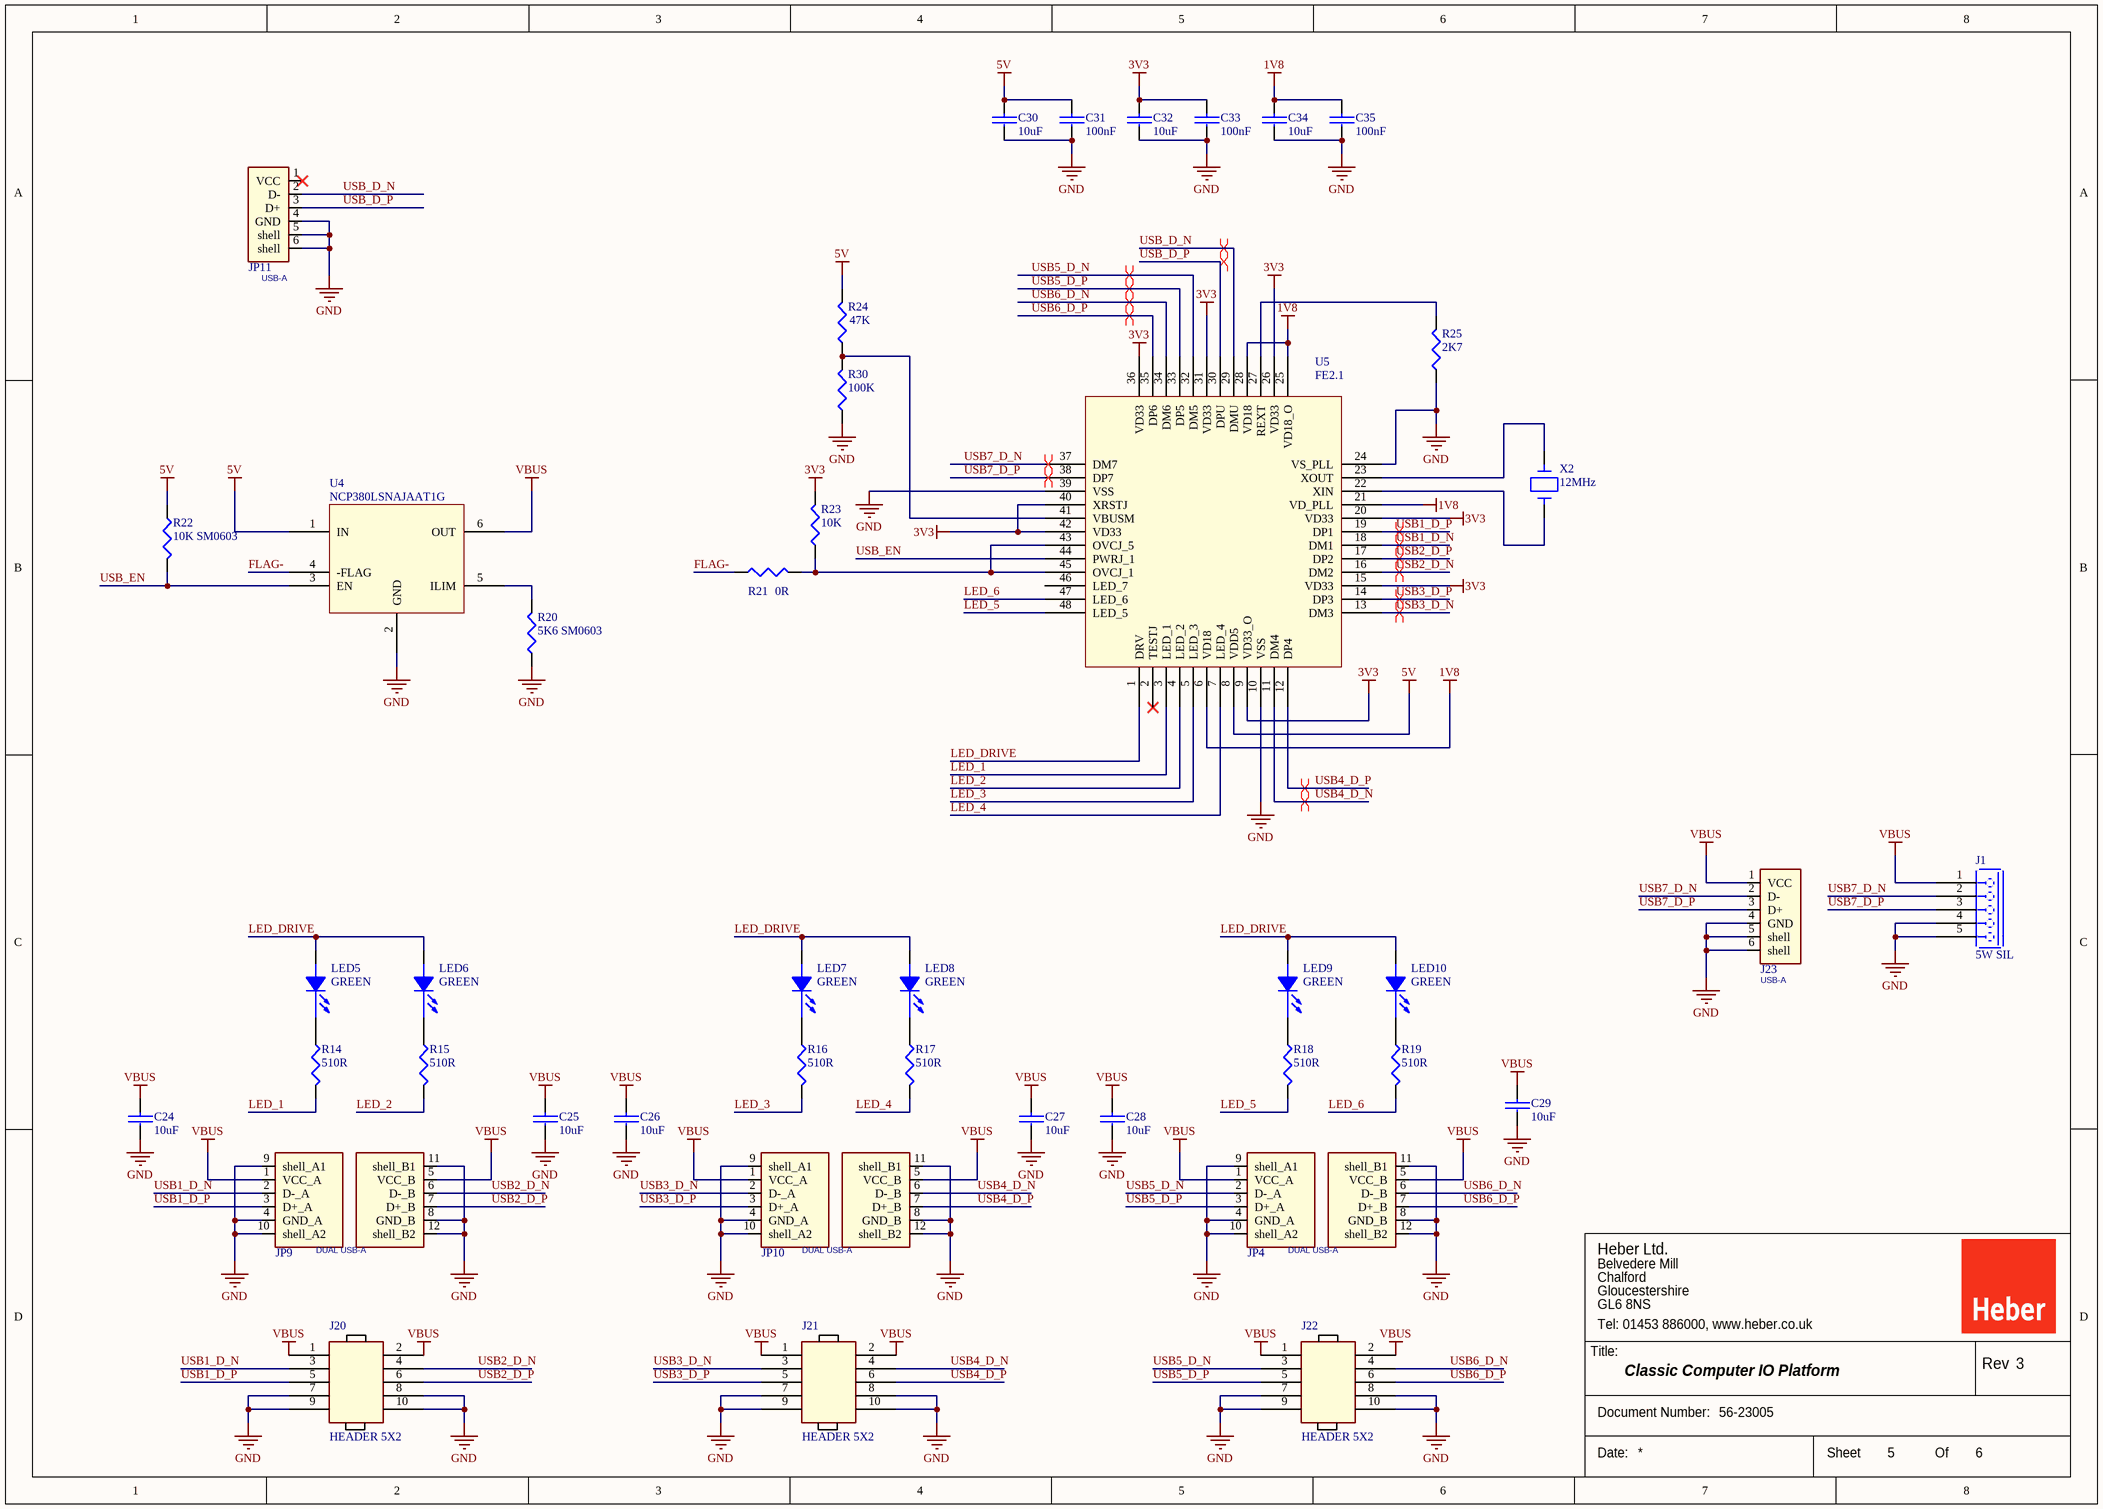
[diagram p4: 23005_5.SchDoc]

### Parts
C24  10uF  [SM0805]
C25  10uF  [SM0805]
C26  10uF  [SM0805]
C27  10uF  [SM0805]
C28  10uF  [SM0805]
C29  10uF  [SM0805]
C30  10uF  [SM0805]
C31  100nF  [SM0603]
C32  10uF  [SM0805]
C33  100nF  [SM0603]
C34  10uF  [SM0805]
C35  100nF  [SM0603]
J1  5W SIL  [5WSIL]
J20  HEADER 5X2  [10WHDR_5X2]
J21  HEADER 5X2  [10WHDR_5X2]
J22  HEADER 5X2  [10WHDR_5X2]
J23  USB-A  [USB_WURTH_61400416021]
JP4  DUAL USB-A  [USB_STACK]
JP9  DUAL USB-A  [USB_STACK]
JP10  DUAL USB-A  [USB_STACK]
JP11  USB-A  [USB_WURTH_61400416021]
LED5  GREEN  [SM0603LED_1]
LED6  GREEN  [SM0603LED_1]
LED7  GREEN  [SM0603LED_1]
LED8  GREEN  [SM0603LED_1]
LED9  GREEN  [SM0603LED_1]
LED10  GREEN  [SM0603LED_1]
R14  510R  [SM0603]
R15  510R  [SM0603]
R16  510R  [SM0603]
R17  510R  [SM0603]
R18  510R  [SM0603]
R19  510R  [SM0603]
R20  5K6 SM0603  [SM0603]
R21  0R  [SM0603]
R22  10K SM0603  [SM0603]
R23  10K  [SM0603]
R24  47K  [SM0603]
R25  2K7  [SM0603]
R30  100K  [SM0603]
U4  NCP380LSNAJAAT1G  [SOT23-6LEAD]
U5  FE2.1  [LQFP48]
X2  12MHz  [HC49_I3]

### Nets
1V8: C34.1 C35.1 U5.6(VD18) U5.21(VD_PLL) U5.25(VD18_O) U5.28(VD18)
3V3: C32.1 C33.1 R23.2 U5.9(VD33_O) U5.15(VD33) U5.20(VD33) U5.26(VD33) U5.31(VD33) U5.36(VD33) U5.40(XRSTJ) U5.42(VD33)
5V: C30.1 C31.1 R22.1 R24.2 U4.1(IN) U5.8(VDD5)
GND: C24.2 C25.2 C26.2 C27.2 C28.2 C29.2 C30.2 C31.2 C32.2 C33.2 C34.2 C35.2 J1.4 J1.5 J20.7 J20.8 J20.9 J20.10 J21.7 J21.8 J21.9 J21.10 J22.7 J22.8 J22.9 J22.10 J23.4(GND) J23.5(shell) J23.6(shell) JP4.4(GND_A) JP4.8(GND_B) JP4.9(shell_A1) JP4.10(shell_A2) JP4.11(shell_B1) JP4.12(shell_B2) JP9.4(GND_A) JP9.8(GND_B) JP9.9(shell_A1) JP9.10(shell_A2) JP9.11(shell_B1) JP9.12(shell_B2) JP10.4(GND_A) JP10.8(GND_B) JP10.9(shell_A1) JP10.10(shell_A2) JP10.11(shell_B1) JP10.12(shell_B2) JP11.4(GND) JP11.5(shell) JP11.6(shell) R20.1 R25.1 R30.1 U4.2(GND) U5.10(VSS) U5.24(VS_PLL) U5.39(VSS)
VBUS: C24.1 C25.1 C26.1 C27.1 C28.1 C29.1 J1.1 J20.1 J20.2 J21.1 J21.2 J22.1 J22.2 J23.1(VCC) JP4.1(VCC_A) JP4.5(VCC_B) JP9.1(VCC_A) JP9.5(VCC_B) JP10.1(VCC_A) JP10.5(VCC_B) U4.6(OUT)
FLAG-: R21.1 U4.4(-FLAG)
LED_1: R14.2 U5.3(LED_1)
LED_2: R15.2 U5.4(LED_2)
LED_3: R16.2 U5.5(LED_3)
LED_4: R17.2 U5.7(LED_4)
LED_5: R18.2 U5.48(LED_5)
LED_6: R19.2 U5.47(LED_6)
LED_DRIVE: LED5.1(ANODE) LED6.1(ANODE) LED7.1(ANODE) LED8.1(ANODE) LED9.1(ANODE) LED10.1(ANODE) U5.1(DRV)
USB1_D_N: J20.3 JP9.2(D-_A) U5.18(DM1)
USB1_D_P: J20.5 JP9.3(D+_A) U5.19(DP1)
USB2_D_N: J20.4 JP9.6(D-_B) U5.16(DM2)
USB2_D_P: J20.6 JP9.7(D+_B) U5.17(DP2)
USB3_D_N: J21.3 JP10.2(D-_A) U5.13(DM3)
USB3_D_P: J21.5 JP10.3(D+_A) U5.14(DP3)
USB4_D_N: J21.4 JP10.6(D-_B) U5.11(DM4)
USB4_D_P: J21.6 JP10.7(D+_B) U5.12(DP4)
USB5_D_N: J22.3 JP4.2(D-_A) U5.32(DM5)
USB5_D_P: J22.5 JP4.3(D+_A) U5.33(DP5)
USB6_D_N: J22.4 JP4.6(D-_B) U5.34(DM6)
USB6_D_P: J22.6 JP4.7(D+_B) U5.35(DP6)
USB7_D_N: J1.2 J23.2(D-) U5.37(DM7)
USB7_D_P: J1.3 J23.3(D+) U5.38(DP7)
USB_D_N: JP11.2(D-) U5.29(DMU)
USB_D_P: JP11.3(D+) U5.30(DPU)
USB_EN: R22.2 U4.3(EN) U5.44(PWRJ_1)
NetLED5_2: LED5.2(CATHODE) R14.1
NetLED6_2: LED6.2(CATHODE) R15.1
NetLED7_2: LED7.2(CATHODE) R16.1
NetLED8_2: LED8.2(CATHODE) R17.1
NetLED9_2: LED9.2(CATHODE) R18.1
NetLED10_2: LED10.2(CATHODE) R19.1
NetR20_2: R20.2 U4.5(ILIM)
NetR21_2: R21.2 R23.1 U5.43(OVCJ_5) U5.45(OVCJ_1)
NetR24_1: R24.1 R30.2 U5.41(VBUSM)
NetR25_2: R25.2 U5.27(REXT)
NetU5_22: U5.22(XIN) X2.2
NetU5_23: U5.23(XOUT) X2.1

Not connected (* = marked no-connect by the designer): JP11 1(VCC)*; U5 2(TESTJ)* 46(LED_7)

### Layout directives
differential pair; differential pair class USB_90R: USB1_D_N, USB1_D_P, USB2_D_N, USB2_D_P, USB3_D_N, USB3_D_P, USB4_D_N, USB4_D_P, USB5_D_N, USB5_D_P, USB6_D_N, USB6_D_P, USB7_D_N, USB7_D_P, USB_D_N, USB_D_P

### Notes on the sheet
- Heber Ltd.
- Belvedere Mill
- Chalford
- GL6 8NS
- Gloucestershire
- Tel: 01453 886000, www.heber.co.uk
- Title:
- Rev
- Document Number:
- Date:
- Sheet
- Of

### Library data of the parts
C24-C35 = C
J1 = HEADER 5W SIL
JP4 JP9 JP10 = USB-A_DUAL
LED5-LED10 = LED
R14-R25 R30 = RES
X2 = XTAL

## Sheet 23005_6.SchDoc: Classic Computer IO Platform
size A3; Date: 06/11/2018; CompanyName: Heber Ltd; Organization: Heber Limited; DocumentNumber: 56-23005; Revision: 3; SheetNumber: 6; SheetTotal: 6
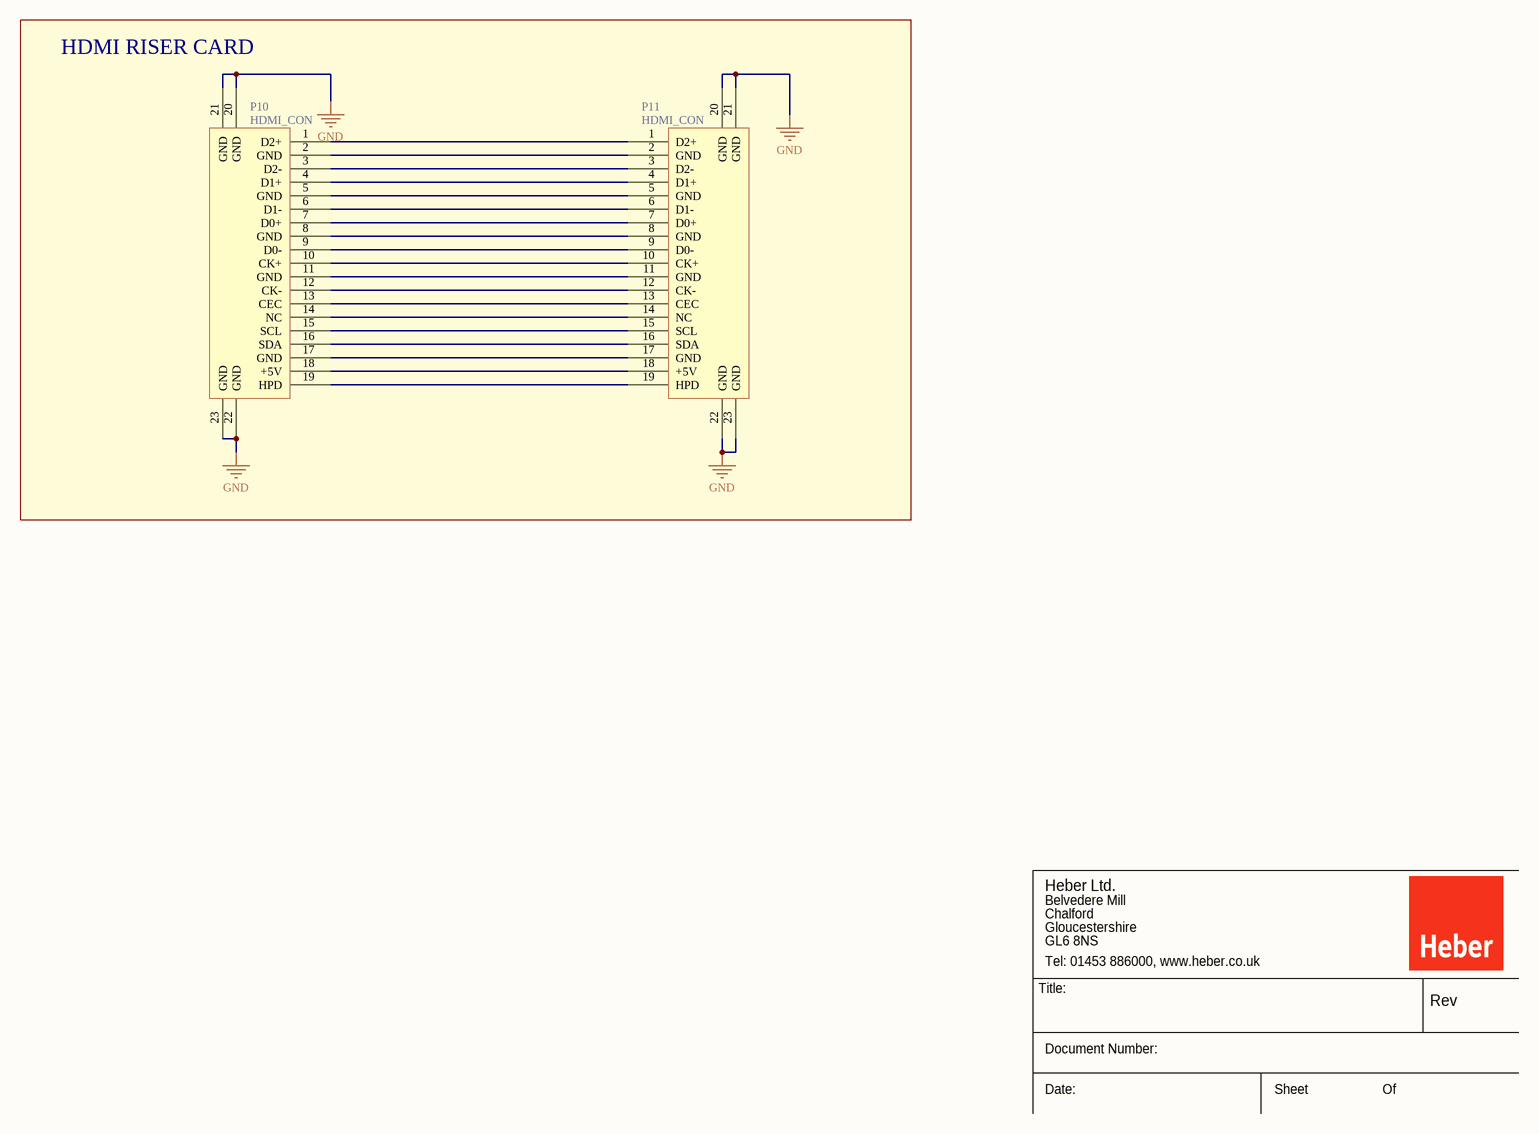
[diagram p5: 23005_6.SchDoc]

### Parts
P10  HDMI_CON  [HDMI_VERT_PTH]
P11  HDMI_CON  [HDMI_VERT_PTH]

### Blocks framed on the sheet
HDMI RISER CARD: P10 P11

### Nets
GND: P10.20(GND) P10.21(GND) P10.22(GND) P10.23(GND) P11.20(GND) P11.21(GND) P11.22(GND) P11.23(GND)
NetP10_1: P10.1(D2+) P11.1(D2+)
NetP10_2: P10.2(GND) P11.2(GND)
NetP10_3: P10.3(D2-) P11.3(D2-)
NetP10_4: P10.4(D1+) P11.4(D1+)
NetP10_5: P10.5(GND) P11.5(GND)
NetP10_6: P10.6(D1-) P11.6(D1-)
NetP10_7: P10.7(D0+) P11.7(D0+)
NetP10_8: P10.8(GND) P11.8(GND)
NetP10_9: P10.9(D0-) P11.9(D0-)
NetP10_10: P10.10(CK+) P11.10(CK+)
NetP10_11: P10.11(GND) P11.11(GND)
NetP10_12: P10.12(CK-) P11.12(CK-)
NetP10_13: P10.13(CEC) P11.13(CEC)
NetP10_14: P10.14(NC) P11.14(NC)
NetP10_15: P10.15(SCL) P11.15(SCL)
NetP10_16: P10.16(SDA) P11.16(SDA)
NetP10_17: P10.17(GND) P11.17(GND)
NetP10_18: P10.18(+5V) P11.18(+5V)
NetP10_19: P10.19(HPD) P11.19(HPD)

### Notes on the sheet
- Heber Ltd.
- Belvedere Mill
- Chalford
- GL6 8NS
- Gloucestershire
- Tel: 01453 886000, www.heber.co.uk
- Title:
- Rev
- Document Number:
- Date:
- Sheet
- Of

## Nets that join several sheets
3V3: 23005_1 (5 pins), 23005_3 (5 pins), 23005_4 (29 pins), 23005_5 (11 pins)
3V3_MEM: 23005_1 (JP1.29), 23005_2 (30 pins)
5V: 23005_1 (7 pins), 23005_3 (7 pins), 23005_4 (J17.1), 23005_5 (6 pins)
9V: 23005_1 (JP5.8), 23005_3 (J10.3)
GND: 23005_1 (27 pins), 23005_2 (28 pins), 23005_3 (46 pins), 23005_4 (10 pins), 23005_5 (57 pins), 23005_6 (8 pins)
V_SNAC: 23005_1 (P5.42), 23005_4 (10 pins)
VBUS: 23005_1 (P5.1 P5.2), 23005_5 (21 pins)
A0: 23005_1 (JP1.37), 23005_2 (U2.23 U3.23)
A1: 23005_1 (JP1.38), 23005_2 (U2.24 U3.24)
A2: 23005_1 (JP1.39), 23005_2 (U2.25 U3.25)
A3: 23005_1 (JP1.40), 23005_2 (U2.26 U3.26)
A4: 23005_1 (JP1.28), 23005_2 (U2.29 U3.29)
A5: 23005_1 (JP1.25), 23005_2 (U2.30 U3.30)
A6: 23005_1 (JP1.26), 23005_2 (U2.31 U3.31)
A7: 23005_1 (JP1.23), 23005_2 (U2.32 U3.32)
A8: 23005_1 (JP1.24), 23005_2 (U2.33 U3.33)
A9: 23005_1 (JP1.21), 23005_2 (U2.34 U3.34)
A10: 23005_1 (JP1.36), 23005_2 (U2.22 U3.22)
A11: 23005_1 (JP1.22), 23005_2 (U2.15 U2.35 U3.15 U3.35)
A12: 23005_1 (JP1.19), 23005_2 (U2.36 U2.39 U3.36 U3.39)
BA0: 23005_1 (JP1.34), 23005_2 (U2.20 U3.20)
BA1: 23005_1 (JP1.35), 23005_2 (U2.21 U3.21)
BLUE: 23005_1 (P5.13), 23005_3 (N5.8 N6.8 P1.3 P6.7)
CAS: 23005_1 (JP1.31), 23005_2 (U2.17 U3.17)
CLK: 23005_1 (JP1.20), 23005_2 (U2.38 U3.38)
CS1: 23005_1 (JP1.33), 23005_2 (U1.2 U2.19)
CTS: 23005_1 (JP2.6), 23005_4 (N16.1 N20.4)
DQ0: 23005_1 (JP1.1), 23005_2 (U2.2 U3.2)
DQ1: 23005_1 (JP1.2), 23005_2 (U2.4 U3.4)
DQ2: 23005_1 (JP1.3), 23005_2 (U2.5 U3.5)
DQ3: 23005_1 (JP1.4), 23005_2 (U2.7 U3.7)
DQ4: 23005_1 (JP1.5), 23005_2 (U2.8 U3.8)
DQ5: 23005_1 (JP1.6), 23005_2 (U2.10 U3.10)
DQ6: 23005_1 (JP1.7), 23005_2 (U2.11 U3.11)
DQ7: 23005_1 (JP1.8), 23005_2 (U2.13 U3.13)
DQ8: 23005_1 (JP1.18), 23005_2 (U2.42 U3.42)
DQ9: 23005_1 (JP1.17), 23005_2 (U2.44 U3.44)
DQ10: 23005_1 (JP1.16), 23005_2 (U2.45 U3.45)
DQ11: 23005_1 (JP1.15), 23005_2 (U2.47 U3.47)
DQ12: 23005_1 (JP1.14), 23005_2 (U2.48 U3.48)
DQ13: 23005_1 (JP1.13), 23005_2 (U2.50 U3.50)
DQ14: 23005_1 (JP1.10), 23005_2 (U2.51 U3.51)
DQ15: 23005_1 (JP1.9), 23005_2 (U2.53 U3.53)
DSR: 23005_1 (JP2.8), 23005_4 (N16.3 N20.2)
DTR: 23005_1 (JP2.7), 23005_4 (N16.2 N20.3)
FAN_DRIVE: 23005_1 (JP7.12), 23005_3 (J7.1 J8.1)
GREEN: 23005_1 (P5.12), 23005_3 (J15.2 P1.2 P6.11 R10.1)
HV_D+: 23005_1 (P5.35), 23005_4 (N18.7 P7.3 Q7.2)
HV_D-: 23005_1 (P5.36), 23005_4 (N25.5 P7.2 Q10.2)
HV_DRAIN: 23005_1 (P5.38), 23005_4 (N25.7 P7.7 Q9.2)
HV_SSRX+: 23005_1 (P5.37), 23005_4 (N15.5 P7.8 Q5.2)
HV_SSRX-: 23005_1 (P5.41), 23005_4 (N18.5 P7.9 Q8.2)
HV_SSTX+: 23005_1 (P5.40), 23005_4 (N14.7 P7.5 Q3.2)
HV_SSTX-: 23005_1 (P5.39), 23005_4 (N15.7 P7.6 Q6.2)
IO6: 23005_1 (JP2.10), 23005_4 (N16.4 N20.1)
LED_DISK: 23005_1 (JP7.3), 23005_3 (LED2.2)
LED_PWR: 23005_1 (JP7.5), 23005_3 (LED1.2)
LED_USER: 23005_1 (JP7.1), 23005_3 (LED3.2)
NANO_HSYNC: 23005_1 (JP7.20 P5.14), 23005_3 (R7.2)
NANO_LEFT: 23005_1 (JP7.2 P5.8), 23005_3 (N1.2)
NANO_RIGHT: 23005_1 (JP7.7 P5.9), 23005_3 (N1.3)
NANO_VSYNC: 23005_1 (JP7.19 P5.15), 23005_3 (R11.1)
RAS: 23005_1 (JP1.32), 23005_2 (U2.18 U3.18)
RED: 23005_1 (P5.11), 23005_3 (N12.8 N13.8 P1.1 P6.15)
RTS: 23005_1 (JP2.5), 23005_4 (N17.4 N19.2)
RX: 23005_1 (JP2.1), 23005_4 (N17.2 N19.4)
SD_CD: 23005_1 (JP5.3), 23005_4 (P2.11 PP3.1)
SD_CLK: 23005_1 (JP7.14), 23005_4 (P2.5)
SD_CMD: 23005_1 (JP7.8), 23005_4 (P2.3)
SD_DAT0: 23005_1 (JP7.16), 23005_4 (P2.7)
SD_DAT1: 23005_1 (JP7.18), 23005_4 (P2.8)
SD_DAT3: 23005_1 (JP7.4), 23005_4 (P2.1)
SD_DAT4: 23005_1 (JP7.6), 23005_4 (P2.2)
SOG: 23005_1 (JP2.9 P5.16), 23005_3 (R8.2 SW6.3)
SPDIF: 23005_1 (JP7.9 P5.7), 23005_3 (J5.3 R29.2)
SW_OSD: 23005_1 (JP7.13), 23005_3 (J12.1 SW4.1)
SW_RES: 23005_1 (JP7.17), 23005_3 (J11.1 SW3.3 SW3.4)
SW_USER: 23005_1 (JP7.15), 23005_3 (J14.1 SW5.1)
TX: 23005_1 (JP2.2), 23005_4 (N17.3 N19.3)
USB7_D_N: 23005_1 (P5.4), 23005_5 (J1.2 J23.2 U5.37)
USB7_D_P: 23005_1 (P5.3), 23005_5 (J1.3 J23.3 U5.38)
VGA_B1: 23005_1 (JP7.21), 23005_3 (N5.1)
VGA_B2: 23005_1 (JP7.23), 23005_3 (N5.2)
VGA_B3: 23005_1 (JP7.25), 23005_3 (N5.3)
VGA_B4: 23005_1 (JP7.26), 23005_3 (N5.4)
VGA_B5: 23005_1 (JP7.24), 23005_3 (N3.1)
VGA_B6: 23005_1 (JP7.22), 23005_3 (N3.2)
VGA_G1: 23005_1 (JP7.27), 23005_3 (N8.1)
VGA_G2: 23005_1 (JP7.31), 23005_3 (N8.2)
VGA_G3: 23005_1 (JP7.33), 23005_3 (N8.3)
VGA_G4: 23005_1 (JP7.35), 23005_3 (N8.4)
VGA_G5: 23005_1 (JP7.37), 23005_3 (N7.1)
VGA_G6: 23005_1 (JP7.39), 23005_3 (N7.2)
VGA_R1: 23005_1 (JP7.28), 23005_3 (N12.1)
VGA_R2: 23005_1 (JP7.32), 23005_3 (N12.2)
VGA_R3: 23005_1 (JP7.34), 23005_3 (N12.3)
VGA_R4: 23005_1 (JP7.36), 23005_3 (N12.4)
VGA_R5: 23005_1 (JP7.38), 23005_3 (N11.1)
VGA_R6: 23005_1 (JP7.40), 23005_3 (N11.2)
WE: 23005_1 (JP1.27), 23005_2 (U2.16 U3.16)